# EAGLE schematic maxim_breakout (EAGLE 6.1)
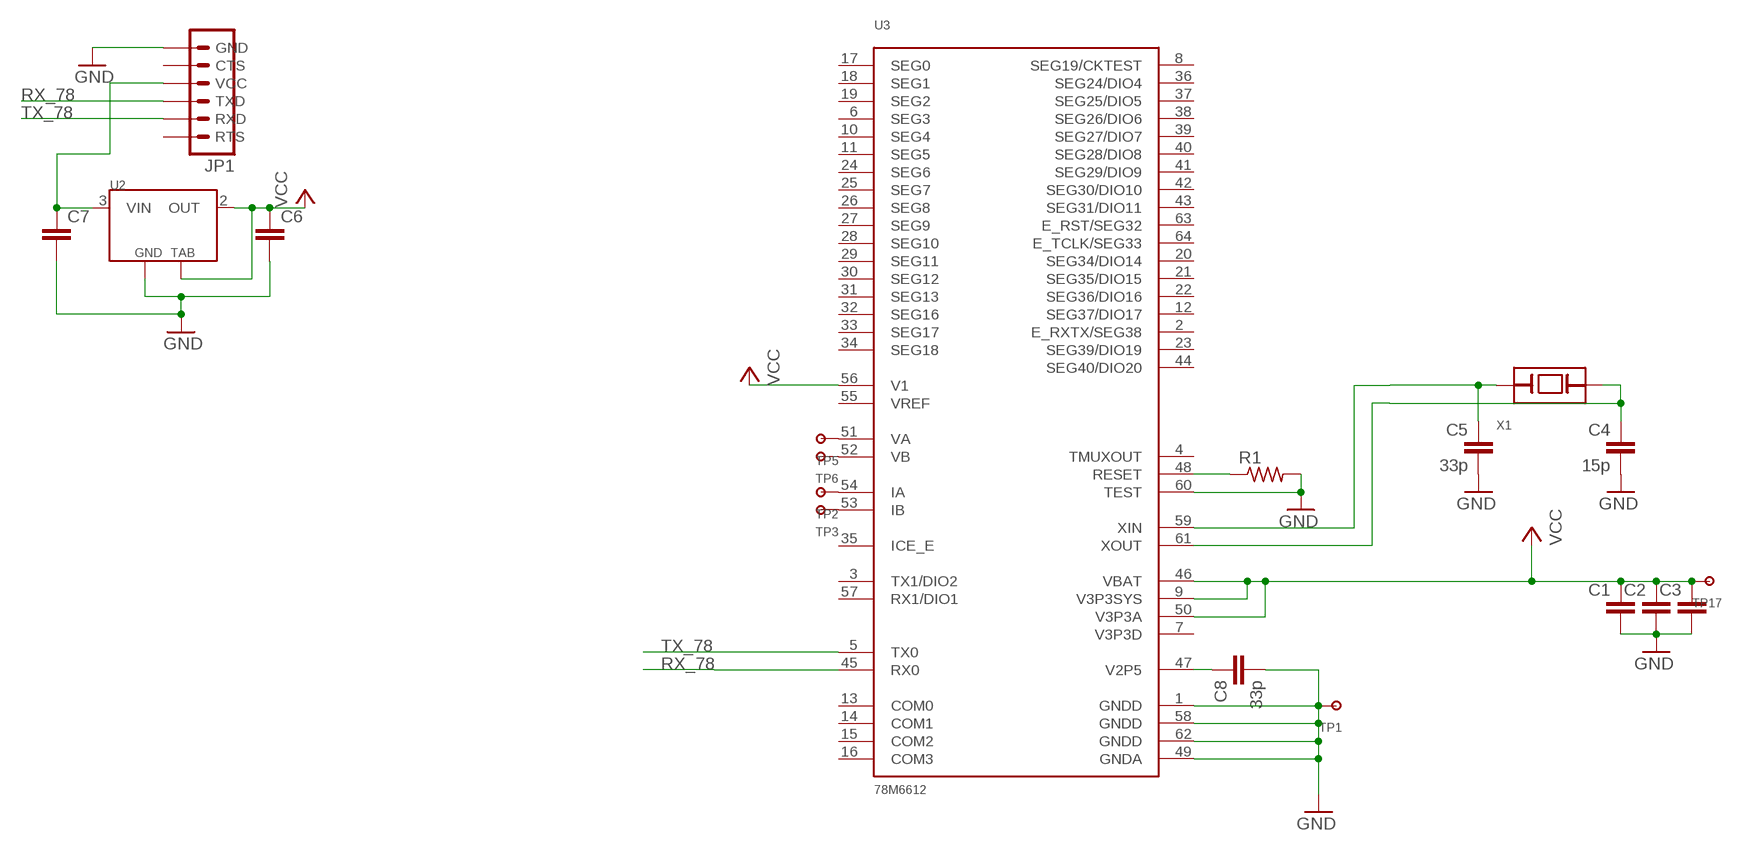
[diagram p0: schematic, sheet 1]

## Parts
C1  CAP0805  [0805]
C2  CAP0805  [0805]
C3  CAP0805  [0805]
C4  15p  CAP0805  [0805]
C5  33p  CAP0805  [0805]
C6  CAP0805  [0805]
C7  CAP0805  [0805]
C8  33p  CAP0805  [0805]
JP1  FTDI_CABLELOCK_LONGPADS  [1X06_LOCK_LONGPADS]
R1  R-US_R0805  [R0805]
TP1  TESTPOINT100MIL  [TESTPOINT-100MIL]
TP2  TESTPOINT100MIL  [TESTPOINT-100MIL]
TP3  TESTPOINT100MIL  [TESTPOINT-100MIL]
TP5  TESTPOINT100MIL  [TESTPOINT-100MIL]
TP6  TESTPOINT100MIL  [TESTPOINT-100MIL]
TP17  TESTPOINT100MIL  [TESTPOINT-100MIL]
U2  NX1117C  [SOT223]
U3  78M6612  [78M6612]
X1  XTALABS07  [ABS07]

## Nets
GND: C1.2 C2.2 C3.2 C4.2 C5.2 C6.2 C7.2 C8.2 JP1.1(GND) R1.2 TP1.2 U2.1(GND) U3.1(GNDD) U3.49(GNDA) U3.58(GNDD) U3.60(TEST) U3.62(GNDD)
N$1: C7.1 JP1.3(VCC) U2.3(VIN)
N$2: R1.1 U3.48(RESET)
N$4: C8.1 U3.47(V2P5)
N$5: TP2.2 U3.54(IA)
N$6: TP3.2 U3.53(IB)
N$7: TP5.2 U3.51(VA)
N$8: TP6.2 U3.52(VB)
N$12: C4.1 U3.61(XOUT) X1.2(B)
N$13: C5.1 U3.59(XIN) X1.1(A)
RX_78: JP1.4(TXD) U3.45(RX0)
TX_78: JP1.5(RXD) U3.5(TX0)
VCC: C1.1 C2.1 C3.1 C6.1 TP17.2 U2.2(OUT) U2.4(TAB) U3.9(V3P3SYS) U3.46(VBAT) U3.50(V3P3A) U3.56(V1)
Unconnected: JP1.2(CTS) JP1.6(RTS) U3.2(E_RXTX/SEG38) U3.3(TX1/DIO2) U3.4(TMUXOUT) U3.6(SEG3) U3.7(V3P3D) U3.8(SEG19/CKTEST) U3.10(SEG4) U3.11(SEG5) U3.12(SEG37/DIO17) U3.13(COM0) U3.14(COM1) U3.15(COM2) U3.16(COM3) U3.17(SEG0) U3.18(SEG1) U3.19(SEG2) U3.20(SEG34/DIO14) U3.21(SEG35/DIO15) U3.22(SEG36/DIO16) U3.23(SEG39/DIO19) U3.24(SEG6) U3.25(SEG7) U3.26(SEG8) U3.27(SEG9) U3.28(SEG10) U3.29(SEG11) U3.30(SEG12) U3.31(SEG13) U3.32(SEG16) U3.33(SEG17) U3.34(SEG18) U3.35(ICE_E) U3.36(SEG24/DIO4) U3.37(SEG25/DIO5) U3.38(SEG26/DIO6) U3.39(SEG27/DIO7) U3.40(SEG28/DIO8) U3.41(SEG29/DIO9) U3.42(SEG30/DIO10) U3.43(SEG31/DIO11) U3.44(SEG40/DIO20) U3.55(VREF) U3.57(RX1/DIO1) U3.63(E_RST/SEG32) U3.64(E_TCLK/SEG33)

## Library data of the parts
C1-C8 = SparkFun:CAP: Capacitor Standard 0603 ceramic capacitor, and 0.1" leaded capacitor.
JP1 = custom:FTDI_CABLE: Header 6 Standard 6-pin 0.1" header. Use with straight break away headers (SKU : PRT-00116), right angle break away headers (PRT-00553), swiss pins (PRT-00743), machine pins (PRT-00117), and female headers (PRT-00115). Molex polarized connector foot print use with SKU : PRT-08094 with associated crimp pins and housings. NOTES ON THE VARIANTS LOCK and LOCK_LONGPADS... This footprint was designed to help hold the alignment of a through-hole component (i.e. 6-pin header) while soldering it into place. You may notice that each hole has been shifted either up or down by 0.005 of an inch from it's more standard position (which is a perfectly straight line). This slight alteration caused the pins (the squares in the middle) to touch the edges of the holes. Because they are alternating, it causes a "brace" to hold the component in place. 0.005 has proven to be the perfect amount of "off-center" position when using our standard breakaway headers. Although looks a little odd when you look at the bare footprint, once you have a header in there, the alteration is very hard to notice. Also, if you push a header all the way into place, it is covered up entirely on the bottom side. This idea of altering the position of holes to aid alignment will be further integrated into the Sparkfun Library for other footprints. It can help hold any component with 3 or more connection pins.
R1 = rcl:R-US_: RESISTOR, American symbol
TP1-TP3 TP5 TP6 TP17 = WSNlib:TESTPOINT: Generic Testpoint
U2 = WSNlib:NX1117C: NX1117C LDO Voltage regulator 1A
U3 = Cool_Electricity:78M6612: 78M6612
X1 = WSNlib:XTAL: Crystals used in OpenMote